# EAGLE design shematic (EAGLE 6.4)
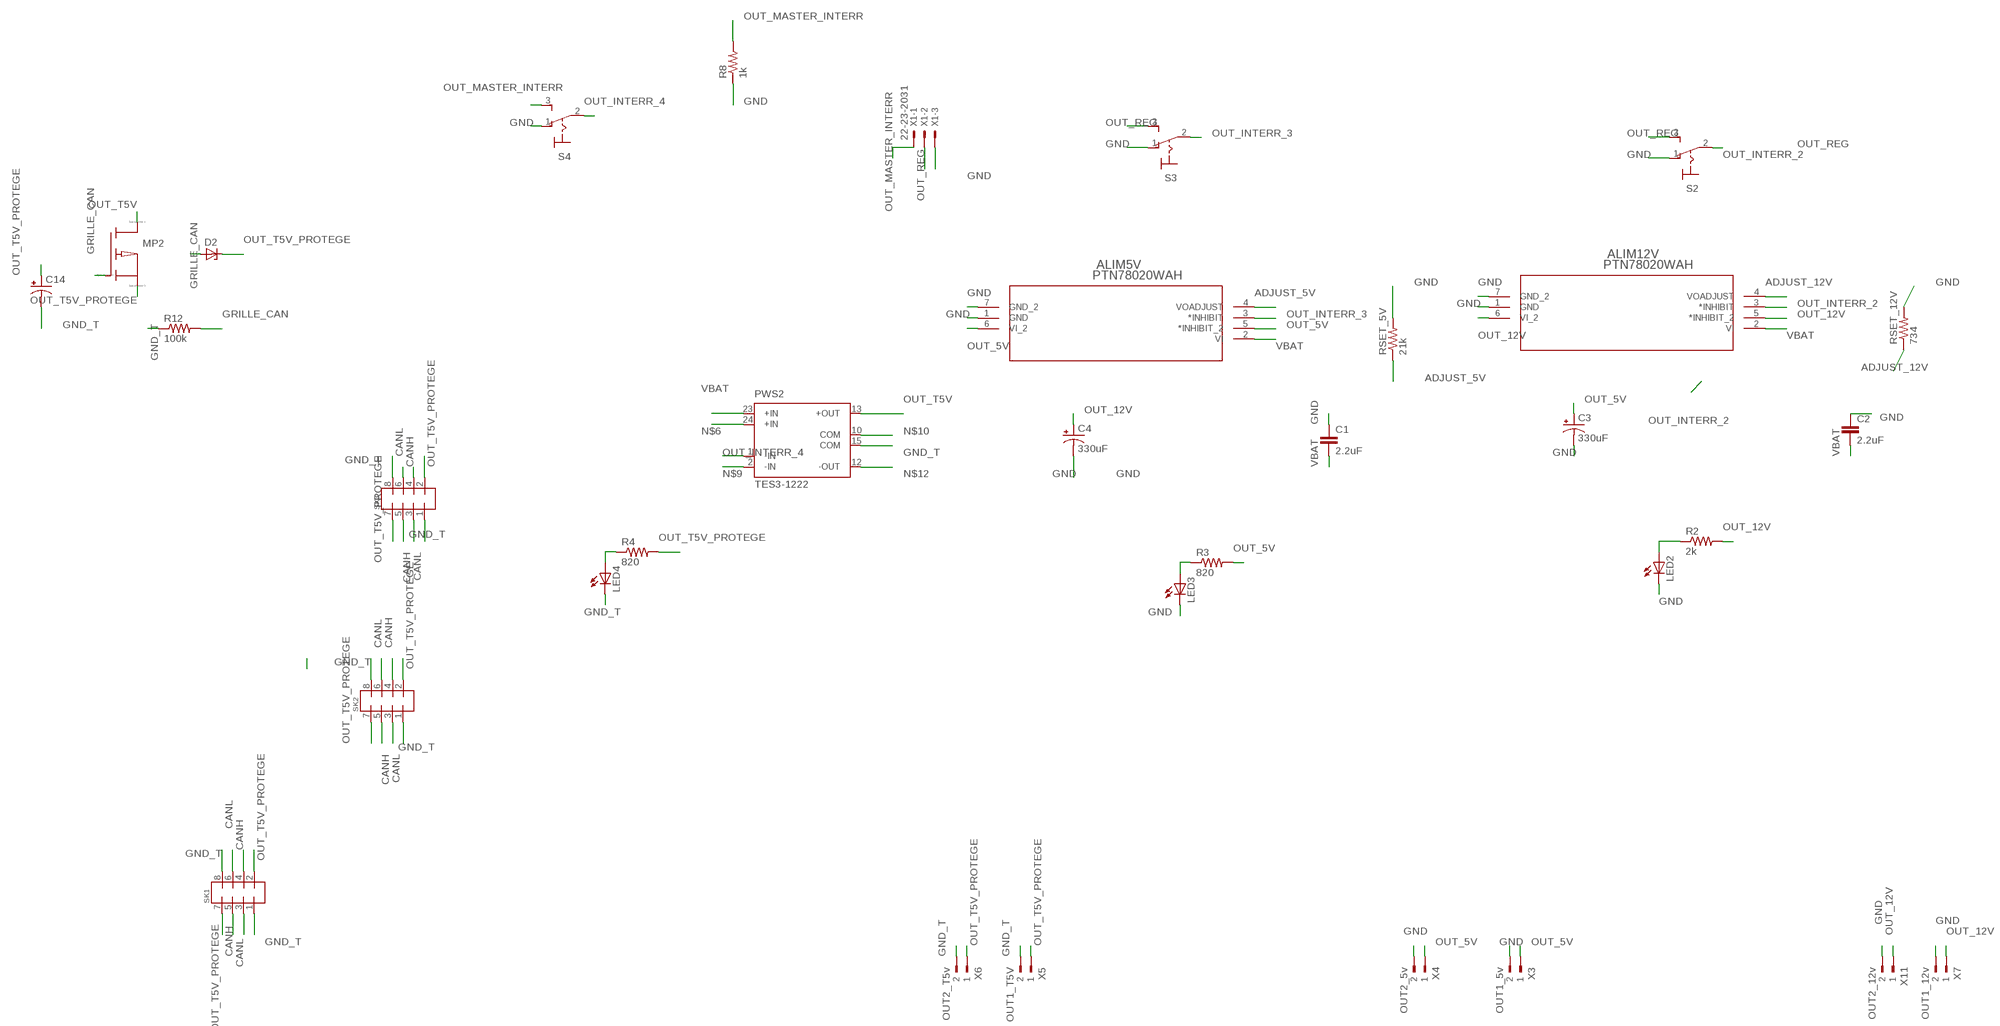
[diagram p0: schematic, sheet 1, part 1 of 2]
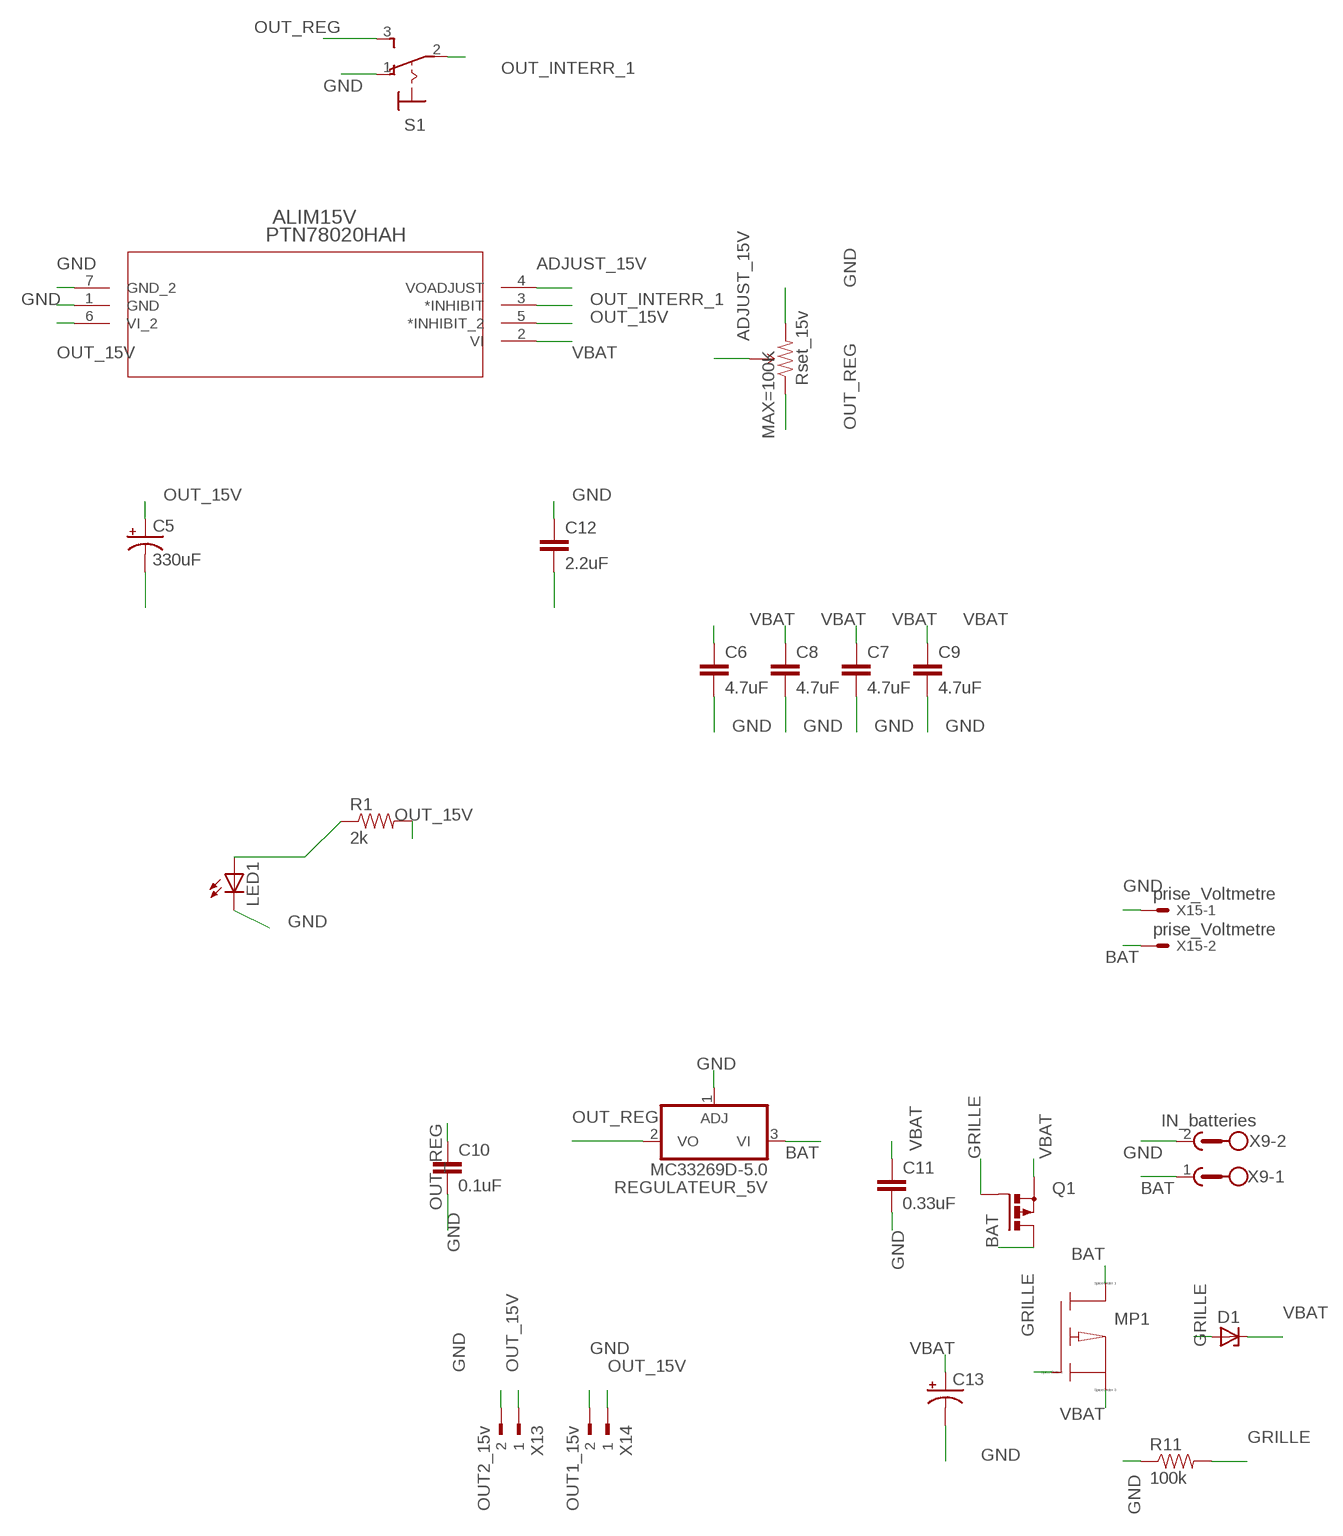
[diagram p1: schematic, sheet 1, part 2 of 2]

## Parts
ALIM5V  PTN78020WAH  PTN78020_  [EUK7]
ALIM12V  PTN78020WAH  PTN78020_  [EUK7]
ALIM15V  PTN78020HAH  PTN78020_  [EUK7]
C1  2.2uF  CAP0805  [0805]
C2  2.2uF  CAP0805  [0805]
C3  330uF  CAP_POLPTH1  [CPOL-RADIAL-100UF-25V]
C4  330uF  CAP_POLPTH1  [CPOL-RADIAL-100UF-25V]
C5  330uF  CAP_POLPTH1  [CPOL-RADIAL-100UF-25V]
C6  4.7uF  CAP0805  [0805]
C7  4.7uF  CAP0805  [0805]
C8  4.7uF  CAP0805  [0805]
C9  4.7uF  CAP0805  [0805]
C10  0.1uF  CAP0805  [0805]
C11  0.33uF  CAP0805  [0805]
C12  2.2uF  CAP0805  [0805]
C13  CAP_POLPTH1  [CPOL-RADIAL-100UF-25V]
C14  CAP_POLPTH1  [CPOL-RADIAL-100UF-25V]
D1  ZENER-DIODESOT23  [SOT23]
D2  ZENER-DIODESOT23  [SOT23]
LED1  LEDCHIP-LED0805  [CHIP-LED0805]
LED2  LEDCHIP-LED0805  [CHIP-LED0805]
LED3  LEDCHIP-LED0805  [CHIP-LED0805]
LED4  LEDCHIP-LED0805  [CHIP-LED0805]
MAX=100K  Rset_15v  TRIMPOT-PTH-KNOB  [3386U]
MP1  PMOS  [SOT23]
MP2  PMOS  [SOT23]
PWS2  TES3-1222  [TES3]
Q1  PMOSFET_PTO220BH  [TO220BH]
R1  2k  RESISTOR0805-RES  [0805]
R2  2k  RESISTOR0805-RES  [0805]
R3  820  RESISTOR0805-RES  [0805]
R4  820  RESISTOR0805-RES  [0805]
R8  1k  RESISTOR0805-RES  [0805]
R11  100k  RESISTOR0805-RES  [0805]
R12  100k  RESISTOR0805-RES  [0805]
REGULATEUR_5V  MC33269D-5.0  [DPACK]
RSET_5V  21k  RESISTOR0805-RES  [0805]
RSET_12V  734  RESISTOR0805-RES  [0805]
S1  M9040P  [M9040P]
S2  M9040P  [M9040P]
S3  M9040P  [M9040P]
S4  M9040P  [M9040P]
SK1  MMATCH-8-PTH  [AMP-215079-8]
SK2  MMATCH-8-PTH  [AMP-215079-8]
SK3  MMATCH-8-PTH  [AMP-215079-8]
X1  22-23-2031  [22-23-2031]
X3  OUT1_5v  90-2  [90-2]
X4  OUT2_5v  90-2  [90-2]
X5  OUT1_T5V  90-2  [90-2]
X6  OUT2_T5v  90-2  [90-2]
X7  OUT1_12v  90-2  [90-2]
X9  IN_batteries  GMSTBA2  [GMSTBA2]
X11  OUT2_12v  90-2  [90-2]
X13  OUT2_15v  90-2  [90-2]
X14  OUT1_15v  90-2  [90-2]
X15  prise_Voltmetre  KK-156-2  [KK-156-2]

## Nets
ADJUST_5V: ALIM5V.4(VOADJUST) RSET_5V.1
ADJUST_12V: ALIM12V.4(VOADJUST) RSET_12V.1
ADJUST_15V: ALIM15V.4(VOADJUST) MAX=100K.2(WIPER)
BAT: MP1.3(D) Q1.D REGULATEUR_5V.3(VI) X9.1 X15.2
CANH: SK1.4 SK1.5 SK2.4 SK2.5 SK3.4 SK3.5
CANL: SK1.3 SK1.6 SK2.3 SK2.6 SK3.3 SK3.6
GND: ALIM5V.1(GND) ALIM5V.7(GND_2) ALIM12V.1(GND) ALIM12V.7(GND_2) ALIM15V.1(GND) ALIM15V.7(GND_2) C1.1 C2.1 C3.2(-) C4.2(-) C5.2(-) C6.2 C7.2 C8.2 C9.2 C10.2 C11.2 C12.1 C13.2(-) LED1.C LED2.C LED3.C MAX=100K.3(CW) R8.1 R11.1 REGULATEUR_5V.1(ADJ) RSET_5V.2 RSET_12V.2 S1.1(O) S2.1(O) S3.1(O) S4.1(O) X1.3 X3.2 X4.2 X7.2 X9.2 X11.2 X13.2 X14.2 X15.1
GND_T: C14.2(-) LED4.C PWS2.15(COM) R12.1 SK1.1 SK1.8 SK2.1 SK2.8 SK3.1 SK3.8 X5.2 X6.2
GRILLE: D1.1(A) MP1.1(G) Q1.G R11.2
GRILLE_CAN: D2.1(A) MP2.1(G) R12.2
N$2: LED1.A R1.1
N$3: LED2.A R2.1
N$4: LED3.A R3.1
N$5: LED4.A R4.1
N$6: PWS2.24(+IN)
N$9: PWS2.2(-IN)
N$10: PWS2.10(COM)
N$12: PWS2.12(-OUT)
OUT_5V: ALIM5V.5(*INHIBIT_2) ALIM5V.6(VI_2) C3.1(+) R3.2 X3.1 X4.1
OUT_12V: ALIM12V.5(*INHIBIT_2) ALIM12V.6(VI_2) C4.1(+) R2.2 X7.1 X11.1
OUT_15V: ALIM15V.5(*INHIBIT_2) ALIM15V.6(VI_2) C5.1(+) R1.2 X13.1 X14.1
OUT_INTERR_1: ALIM15V.3(*INHIBIT) S1.2(P)
OUT_INTERR_2: ALIM12V.3(*INHIBIT) S2.2(P)
OUT_INTERR_3: ALIM5V.3(*INHIBIT) S3.2(P)
OUT_INTERR_4: PWS2.1(-IN) S4.2(P)
OUT_MASTER_INTERR: R8.2 S4.3(S) X1.1
OUT_REG: C10.1 MAX=100K.1(CCW) REGULATEUR_5V.2(VO) S1.3(S) S2.3(S) S3.3(S) X1.2
OUT_T5V: MP2.3(D) PWS2.13(+OUT)
OUT_T5V_PROTEGE: C14.1(+) D2.3(C) MP2.2(S) R4.2 SK1.2 SK1.7 SK2.2 SK2.7 SK3.2 SK3.7 X5.1 X6.1
VBAT: ALIM5V.2(VI) ALIM12V.2(VI) ALIM15V.2(VI) C1.2 C2.2 C6.1 C7.1 C8.1 C9.1 C11.1 C12.2 C13.1(+) D1.3(C) MP1.2(S) PWS2.23(+IN) Q1.S

## Library data of the parts
ALIM5V ALIM12V ALIM15V = ptn78020_:PTN78020_
C1 C2 C6-C12 = SparkFun-Passives:CAP: Capacitor Standard 0603 ceramic capacitor, and 0.1" leaded capacitor.
C3-C5 = SparkFun-Capacitors:CAP_POL: Capacitor Polarized These are standard SMD and PTH capacitors. Normally 10uF, 47uF, and 100uF in electrolytic and tantalum varieties. Always verify the external diameter of the through hole cap, it varies with capacity, voltage, and manufacturer. The EIA devices should be standard.
C13 C14 = SparkFun-Passives:CAP_POL: Capacitor Polarized These are standard SMD and PTH capacitors. Normally 10uF, 47uF, and 100uF in electrolytic and tantalum varieties. Always verify the external diameter of the through hole cap, it varies with capacity, voltage, and manufacturer. The EIA devices should be standard.
D1 D2 = diode:ZENER-DIODE: Z-Diode
LED1-LED4 = adafruit:LED: LED OSRAM: - CHIPLED LG R971, LG N971, LY N971, LG Q971, LY Q971, LO R971, LY R971 LH N974, LH R974 LS Q976, LO Q976, LY Q976 LO Q996 - Hyper CHIPLED LW Q18S LB Q993, LB Q99A, LB R99A - SideLED LS A670, LO A670, LY A670, LG A670, LP A670 LB A673, LV A673, LT A673, LW A673 LH A674 LY A675 LS A676, LA A676, LO A676, LY A676, LW A676 LS A679, LY A679, LG A679 - Hyper Micro SIDELED® LS Y876, LA Y876, LO Y876, LY Y876 LT Y87S - SmartLED LW L88C, LW L88S LB L89C, LB L89S, LG L890 LS L89K, LO L89K, LY L89K LS L896, LA L896, LO L896, LY L896 - TOPLED LS T670, LO T670, LY T670, LG T670, LP T670 LSG T670, LSP T670, LSY T670, LOP T670, LYG T670 LG T671, LOG T671, LSG T671 LB T673, LV T673, LT T673, LW T673 LH T674 LS T676, LA T676, LO T676, LY T676, LB T676, LH T676, LSB T676, LW T676 LB T67C, LV T67C, LT T67C, LS T67K, LO T67K, LY T67K, LW E67C LS E67B, LA E67B, LO E67B, LY E67B, LB E67C, LV E67C, LT E67C LW T67C LS T679, LY T679, LG T679 LS T770, LO T770, LY T770, LG T770, LP T770 LB T773, LV T773, LT T773, LW T773 LH T774 LS E675, LA E675, LY E675, LS T675 LS T776, LA T776, LO T776, LY T776, LB T776 LHGB T686 LT T68C, LB T68C - Hyper Mini TOPLED® LB M676 - Mini TOPLED Santana® LG M470 LS M47K, LO M47K, LY M47K Source: http://www.osram.convergy.de/
MAX=100K = SparkFun-Electromechanical:TRIMPOT: Various small potentiometers for "set-and-forget" applications
MP1 MP2 = sym:PMOS: P-Channel MOSFET transistor
PWS2 = traco-electronic:TES3-: DC/DC Converter Dual Output, 3W Source: Data sheet <http://www.tracopower.com/datasheet_g/tes3-d.pdf>
Q1 = transistor-power:PMOSFET_P: Power MOSFET P-Channel
R1-R4 R8 = SparkFun-Resistors:RESISTOR: Resistor Basic schematic elements and footprints for 0603, 1206, and PTH resistors.
R11 R12 RSET_5V RSET_12V = SparkFun-Passives:RESISTOR: Resistor Basic schematic elements and footprints for 0603, 1206, and PTH resistors.
REGULATEUR_5V = linear:MC33269?*: Adjustable Output Low Dropout Voltage Regulator 800 mA Source: http://www.onsemi.com/pub/Collateral/MC33269-D.PDF
S1-S4 = switch:M9040P: TOGGLE SWITCH Marquardt
SK1-SK3 = jt-con-micromatch:MMATCH-8-*: AMP Micromatch 8-pin
X1 = con-molex:22-23-2031: .100" (2.54mm) Center Header - 3 Pin; MF: MOLEX; MPN: 22-23-2031; OC_FARNELL: 1462950; OC_NEWARK: 30C0862
X3-X7 X11 X13 X14 = con-weidmueller-sl35:90-2: WEIDMUELLER CLAMP CONNECTOR; OC_FARNELL: unknown; OC_NEWARK: unknown
X9 = con-phoenix-762:GMSTBA2: PHOENIX; MF: FARNELL; MPN: 1757242; OC_FARNELL: 3705171; OC_NEWARK: 71C4161
X15 = con-molex:KK-156-2: KK 156 HEADER Source: http://www.molex.com/pdm_docs/sd/026604100_sd.pdf; OC_FARNELL: unknown; OC_NEWARK: unknown

## Net classes
0 default: width 1.016 mm, drill 0.6 mm, clearance 0.3 mm
1 puissance: width 2.86 mm, drill 0.6 mm, clearance 2.86 mm to class 0, clearance 0.073 mm

## Board
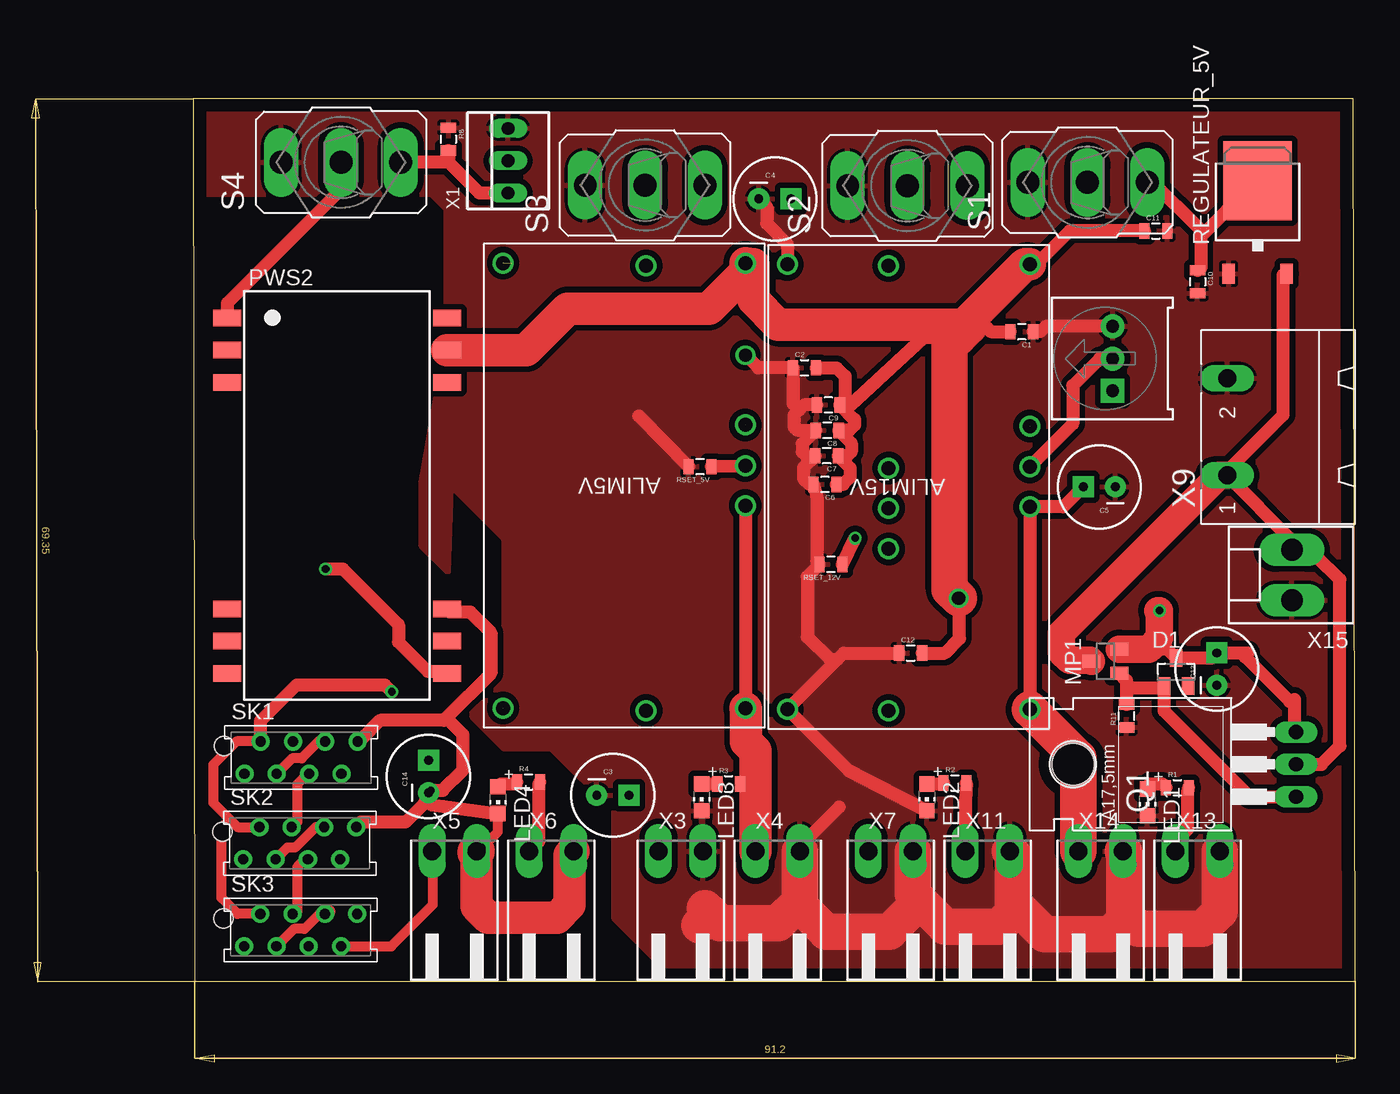
[diagram p2: board, top side]
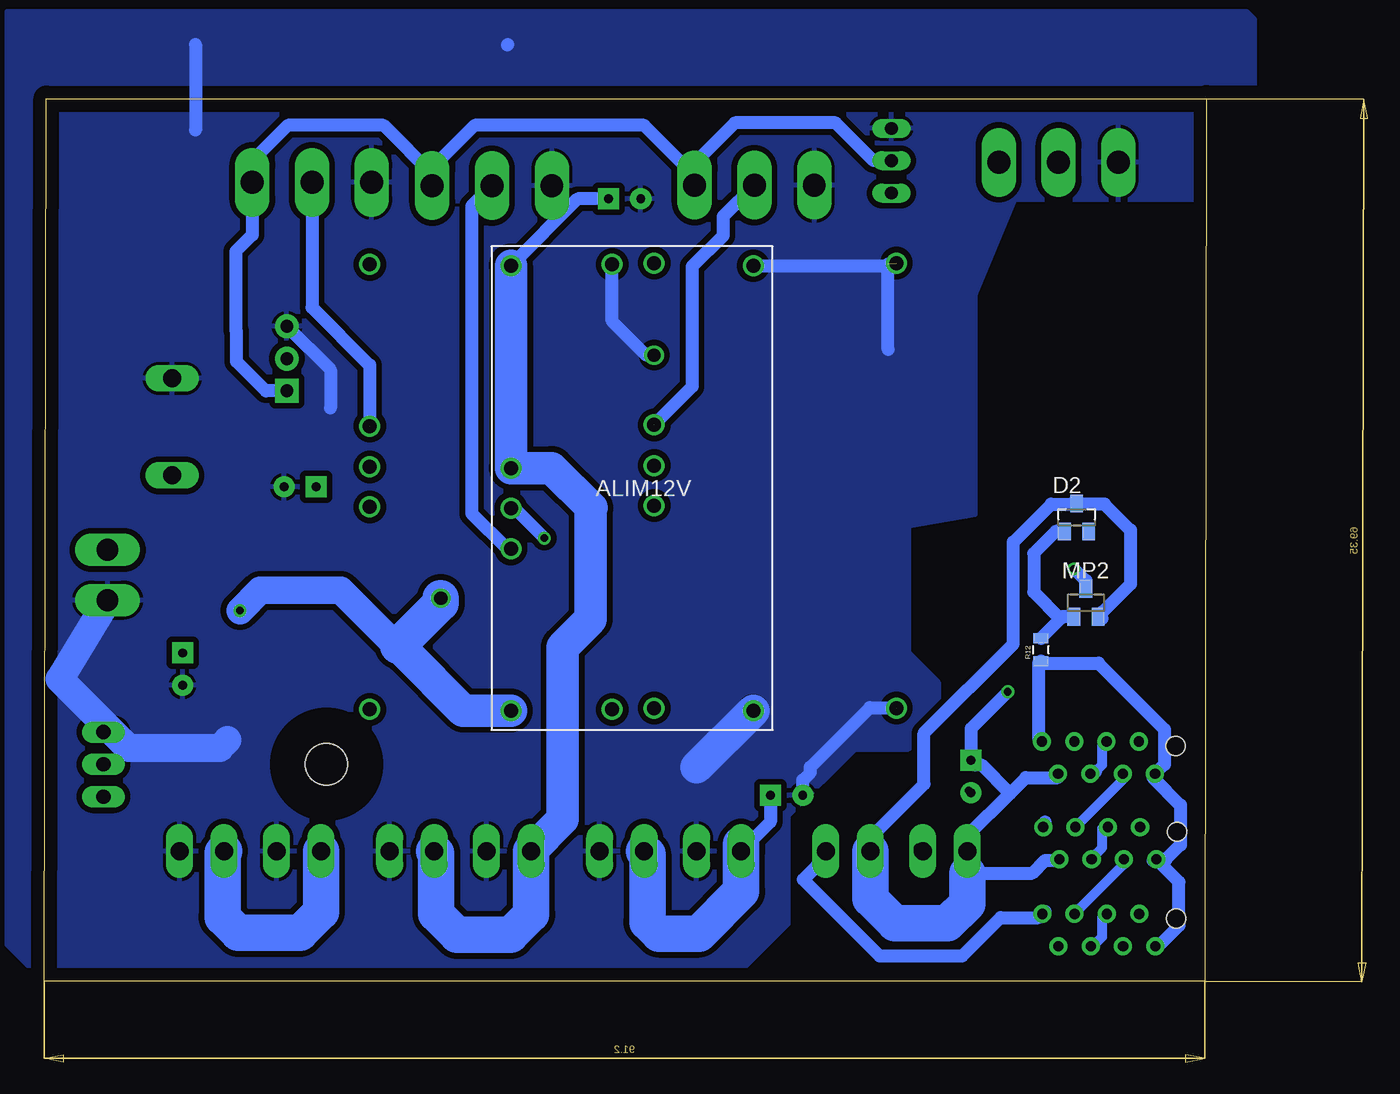
[diagram p3: board, bottom side, seen from below]

Size 91.35 x 69.35 mm. Coordinates in mm from the lower left corner, seen from the top.
Outline: 0.15,0 91.35,0 91.2,69.35 0,69.35 0.15,0
Copper layers (1*16): Top 0.035mm / dielectric 1.5mm / Bottom 0.035mm
Design rules "default *": minimum track width 10mil, minimum drill 24mil, track to track 0.45mm, track to pad 0.45mm, pad to pad 0.45mm, via to via 0.45mm, smd to smd 0.45mm, copper to edge 40mil, drill to drill 8mil, minimum pad ring 10mil, minimum via ring 8mil, stop-mask expansion 4mil, vias tented up to drill 0mil, thermal gap 10mil

### Footprints (pad centres in the part's own frame; a part is rotated, then mirrored left to right if it is on the bottom)
EUK7 = smd 1.016 x 1.016: 1 9.525,-17.475; 2 -9.525,-17.475; 3 -9.525,-4.775; 4 -9.525,-1.575; 5 -9.525,1.575; 6 -9.525,17.475; 7 9.525,17.475 | drill 1.1: P$1 -9.525,-17.475; P$2 -9.525,-4.775; P$3 -9.525,-1.575; P$4 -9.525,1.575; P$5 -9.525,17.475; P$6 9.525,17.475; P$7 9.525,-17.475
0805 = smd 0.8 x 1.2: 1 -0.9,0; 2 0.9,0
CPOL-RADIAL-100UF-25V = drill 0.7 pad 1.651 square: 1 1.27,0 | drill 0.7 pad 1.651: 2 -1.27,0
SOT23 = smd 1 x 1.4: 1 -0.95,-1.1; 2 0.95,-1.1; 3 0,1.1
CHIP-LED0805 = smd 1.2 x 1.2: A 0,-1.05; C 0,1.05
3386U = drill 1.016 pad 1.88 square: 1 -2.54,-0.015 | drill 1.016 pad 1.88: 2 0,-0.015; 3 2.54,-0.015
TES3 = smd 1.3 x 2.2: 1 -13.97,-8.636; 2 -11.43,-8.636; 3 -8.89,-8.636; 10 8.89,-8.636; 11 11.43,-8.636; 12 13.97,-8.636; 13 13.97,8.636; 14 11.43,8.636; 15 8.89,8.636; 22 -8.89,8.636; 23 -11.43,8.636; 24 -13.97,8.636
TO220BH = drill 1.118 long: D 0,-6.35; G -2.54,-6.35; S 2.54,-6.35 | hole 3.302: 0,11.176
DPACK = smd 1 x 1.6: 1 -2.28,-4.8; 3 2.28,-4.8 | smd 5.4 x 6.2: 2 0,2.5
M9040P = drill 1.803 long: 1 0,4.699; 2 0,0; 3 0,-4.699
AMP-215079-8 = drill 0.8 pad 1.422: 1 0,-1.27; 2 1.27,1.27; 3 2.54,-1.27; 4 3.81,1.27; 5 5.08,-1.27; 6 6.35,1.27; 7 7.62,-1.27; 8 8.89,1.27 | hole 1.5: -1.62,0.905
22-23-2031 = drill 1 long: 1 -2.54,0; 2 0,0; 3 2.54,0
90-2 = drill 1.422 long: 1 -1.75,5.25; 2 1.75,5.25
GMSTBA2 = drill 1.397 long: 1 -3.81,5.08; 2 3.81,5.08
KK-156-2 = drill 1.7 pad 2.184 long: 1 -1.98,0; 2 1.98,0

### Placement (x,y rotation side)
ALIM5V  33.9,38.95 180 top
ALIM12V  45.15,38.75 0 bottom
ALIM15V  56.25,38.85 180 top
C1  65.14,51.04 180 top
C2  48.07,48.21 0 top
C3  33.01,14.61 0 top
C4  45.74,61.48 0 top
C5  71.24,38.85 180 top
C6  49.67,39.04 180 top
C7  49.81,41.29 180 top
C8  49.85,43.29 180 top
C9  49.94,45.29 180 top
C10  78.95,54.97 270 top
C11  75.68,58.96 0 top
C12  56.41,25.79 0 top
C13  80.48,24.53 90 top
C14  18.51,16.09 90 top
D1  77.28,24.3 0 top
D2  10.22,36.45 0 bottom
LED1  75.03,14.05 180 top
LED2  57.69,14.45 180 top
LED3  39.99,14.45 180 top
LED4  23.97,14.23 180 top
MAX=100K  72.27,48.93 90 top
MP1  71.71,25.15 90 top
MP2  9.48,29.75 0 bottom
PWS2  11.33,38.16 270 top
Q1  80.35,17.05 90 top
R1  77.38,15.21 0 top
R2  59.89,15.59 0 top
R3  42.11,15.52 0 top
R4  26.37,15.66 0 top
R8  20.07,66.17 270 top
R11  73.38,20.85 90 top
R12  13.02,26.05 90 bottom
REGULATEUR_5V  83.69,60.4 0 top
RSET_5V  39.85,40.44 180 top
RSET_12V  50.14,32.76 180 top
S1  70.31,62.77 90 top
S2  56.16,62.52 90 top
S3  35.54,62.56 90 top
S4  11.63,64.35 90 top
SK1  4.05,17.57 0 top
SK2  3.95,10.85 0 top
SK3  4.02,4.03 0 top
X1  24.77,64.47 90 top
X3  38.33,4.98 0 top
X4  45.95,4.98 0 top
X5  20.55,4.98 0 top
X6  28.17,4.98 0 top
X7  54.84,4.98 0 top
X9  86.38,43.56 90 top
X11  62.46,4.98 0 top
X13  78.97,4.98 0 top
X14  71.35,4.98 0 top
X15  86.38,31.92 90 top

### Tracks (layer width: path | path; a pad name or v marks a point on that pad's centre or on a via)
ADJUST_5V
  Top 1.016: RSET_5V.1 40.89,40.48 ALIM5V.4
ADJUST_12V  (via drill 0.6)
  Top 1.016: RSET_12V.1 v52.05,34.83
  Bottom 0.406: 54.4,37.17 ALIM12V.4
  Bottom 1.016: v52.05,34.83 54.4,37.17
ADJUST_15V
  Top 1.016: MAX=100K.2 71.28,48.93 69.15,46.8 69.15,43.8 ALIM15V.4
BAT
  Top 1.016: Q1.D 88.7,17.05 90.15,18.5 90.15,31.58 88.35,33.38 86.91,33.38 X15.2 86.38,34.67 X9.1 81.7,40.5 85.7,44.5 85.7,55.5 REGULATEUR_5V.3
  Top 2.18: MP1.3 70.53,25.23 68.92,25.23 68.28,25.88 68.28,27.35 80.68,39.76 X9.1
CANH
  Top 0.8: SK2.4 8.2,12.5 8.2,15.5 8.7,16 SK1.5 | SK3.4 8.2,5.5 8.2,9 8.7,9.5 SK2.5
  Bottom 0.8: SK3.4 8.2,5 8.2,3.5 8.7,3 SK3.5 | SK2.4 8.2,12 8.2,10.5 8.7,10 SK2.5 | 8.7,16.5 8.2,17 8.2,18.5 SK1.4
  Bottom 1.016: 8.7,16.5 SK1.5
CANL
  Top 0.8: SK1.6 9.87,18.84 8.55,17.52 7.81,17.52 SK1.3 | SK2.3 7.41,10.5 8.02,10.5 9.64,12.12 SK2.6 | SK3.6 9.95,5.29 8.77,4.12 7.93,4.12 SK3.3
  Top 1.016: 10.7,5.5 SK3.6
  Bottom 0.8: SK1.3 6.59,15.83 SK2.6 | SK2.3 6.49,9.18 SK3.6
GND  (via drill 1)  (2 unrouted)
  Top 1.016: 56.75,9.86 56.59,9.7 | C9.2 48.04,45.29 47.65,44.9 | 47.65,44.9 47.25,44.5 47.25,43.55 47.5,43.3 C8.2 47.9,42.24 47.9,41.6 48.21,41.29 C7.2 48,40.38 48,39.5 48.46,39.04 C6.2 49.04,38.11 49.04,33.01 RSET_12V.2 48.3,31.82 48.3,27.05 50.05,25.3 50.65,25.3 | 50.79,13.69 47.7,10.6 X4.2 | 50.65,25.3 ALIM15V.7 51.51,16.59 LED2.C | 50.65,25.3 51.14,25.79 C12.1 | RSET_5V.2 35.05,44.41 | MAX=100K.3 67.02,51.47 66.6,51.05 C1.1 | C4.2 45.1,60.85 45.1,59.55 46.73,57.92 ALIM15V.1 | 47.65,44.9 47.17,45.38 C2.1 44.44,48.21 v43.45,49.2
  Top 2.86: 40.25,5.75 40.7,5.3 | 40.7,5.3 41.45,4.55 46,4.55 47.7,6.25 X4.2 47.7,5.95 49.75,3.9 54.75,3.9 57.15,6.3 | X11.2 64.45,9.99 64.45,6.2 | 64.45,6.2 64.45,5.4 63.35,4.3 59.15,4.3 57.15,6.3 | 57.15,6.3 56.59,6.86 56.59,9.7 X7.2 | X14.2 73.2,10.13 73.2,5.3 73.45,5.05 | 73.45,5.05 74.35,4.15 79.35,4.15 80.72,5.52 X13.2 | 39.8,4.4 40.7,5.3 | 64.45,6.2 66.95,3.7 72.1,3.7 73.45,5.05
  Bottom 1.016: 54.91,73.59 54.95,73.55 | MAX=100K.3 68.85,48.03 68.85,45.05 | 72.4,38.96 C5.2 | v43.45,49.2 44.05,49.2 46.73,51.88 ALIM15V.1 | 79.46,73.59 79.46,66.89 | ALIM12V.7 25.02,56.23 | 25.02,56.23 25.02,56.38 | 25.02,49.65 25.02,56.23 | C3.2 31.74,15.81 31.15,16.4 31.15,16.82 26.47,21.5 24.4,21.5 ALIM5V.7
  Bottom 2.184: X15.1 90.15,23.75 84.75,18.35 77.55,18.35 76.95,18.95
  Bottom 2.56: ALIM12V.1 40.08,16.82
  pour Bottom (isolate 0.254): -3.8,75.55 -3.15,76.2 94.3,76.2 94.3,2.9 92.45,1.05 36.35,1.05 32.85,4.55 32.85,13.05 27.65,18.25 23.45,18.25 21.05,20.65 21.05,23.45 23.4,25.8 23.4,35.8 18.15,36.7 18.15,54 15.05,61.45 -2.25,61.45 -3.8,63
  pour Top (isolate 0.305): -4.55,76.3 -4.45,76.2 94.75,76.2 94.35,75.8 94.35,3.3 91.95,0.9 37.1,0.9 33.1,4.9 33.1,13.35 28.2,18.25 24.45,18.25 21.95,20.75 21.95,22.95 24.45,25.45 24.45,34.75 20.3,38.9 20.05,32.1 17.95,34.2 17.95,39.2 19.9,50.4 19.9,60.65 18.75,61.8 -1.3,61.8 -4.55,65.05
GND_T  (via drill 0.6)
  Top 0.8: v22.7,10.5 23.97,11.77 LED4.C
  Top 1.016: 21.83,10.7 X5.2 | 21.8,10.73 X5.2 | LED4.C 19.67,13.75 18.68,13.88 C14.2 18.2,14 16.7,12.5 13.2,12.5 SK2.8 | 21.88,10.65 X5.2 | PWS2.15 20.2,29 21.8,29 23.43,27.38 23.43,24.23 19.9,20.7 | SK1.8 13.2,19 14.7,20.5 19.7,20.5 19.9,20.7 | v18.7,15 19.62,15 21.22,16.6 21.22,19.38 19.9,20.7
  Top 2.54: X5.2 22.3,5.9 23.2,5 28.6,5 29.6,6 29.6,9.91 X6.2
  Top 2.86: X5.2 22.2,10.13
  Bottom 1.016: 12.7,12.5 SK2.8 | 4.2,9.5 SK2.1 | 12.7,5.5 SK3.8 13.2,5 16.2,5 19.2,2 25.7,2 31.7,8 29.7,10 X6.2 | 13.2,25 R12.1 | v22.7,10.5 X5.2 | v18.7,15 C14.2 | SK3.1 3.8,2.75 2.17,4.38 2.17,7.8 SK2.1 | SK2.1 3.2,9.58 2.05,10.72 2.05,13.85 4.2,16 SK1.1 3.3,17.05 3.3,19.8 8.5,25 13.2,25 | 13.2,25 13.2,19.11 SK1.8
GRILLE
  Top 1.016: MP1.1 73.38,23.64 73.38,23.02 | 73.38,23.02 R11.2 | 73.38,23.02 76.15,23.02 D1.1 76.33,21.25 83.06,14.51 Q1.G
GRILLE_CAN
  Bottom 1.016: MP2.1 11.31,28.65 11.47,28.5 | 11.47,28.5 R12.2 | D2.1 11.85,35.35 13.57,33.62 13.57,30.6 11.47,28.5
N$2
  Top 1.016: LED1.A 75.2,15.5 76.2,15.5 R1.1
N$3
  Top 1.016: LED2.A 57.7,15.5 58.7,15.5 R2.1
N$4
  Top 1.016: LED3.A 40.2,15.5 41.2,15.5 R3.1
N$5
  Top 1.016: 24.12,15.19 LED4.A 24.2,15.5 25.2,15.5 R4.1
N$7  (via drill 1)
  other vias: 60.15,30.1
N$16  (via drill 1)
  other vias: 43.4,49.2
OUT_5V
  Top 0.5: R3.2 43.74,15.2 44.2,17.05
  Top 1.016: ALIM5V.5 ALIM5V.6
  Top 2.56: ALIM5V.6 43.48,21.43 43.48,18.82 44.2,18.1 44.2,17.05 X4.1
  Bottom 1.016: C3.1 34.28,12.53 X3.1
  Bottom 2.86: X4.1 43.95,9.98 43.95,4.65 43.05,3.75 39.9,3.75 36.58,7.07 X3.1 36.58,10.77
OUT_12V
  Top 1.016: 60.65,10.29 X11.1 60.71,14.17 R2.2
  Bottom 1.016: C4.1 49.42,61.48 ALIM12V.6
  Bottom 2.56: X7.1 50.6,12.72 50.6,26.25 48.4,28.45 48.4,37.15 48.35,37.2 51.48,40.33 ALIM12V.5 ALIM12V.6
  Bottom 2.86: X11.1 60.55,10.07 60.55,5.3 58.9,3.65 54.7,3.65 53.09,5.26 X7.1
OUT_15V
  Top 1.016: 77.22,11.27 X13.1 77.7,11.5 78.2,12 78.2,15 R1.2 | C5.1 68.39,37.27 ALIM15V.5 ALIM15V.6
  Top 2.86: ALIM15V.6 69.6,17.55 X14.1
  Bottom 2.86: X13.1 77.35,10.1 77.35,5.05 76.1,3.8 71.25,3.8 69.6,5.45 X14.1
OUT_INTERR_1  (1 unrouted)
  Bottom 1.016: S1.2 70.31,52.96 65.78,48.42 ALIM15V.3
OUT_INTERR_2
  Bottom 1.016: S2.2 57.75,60.92 57.75,36.75 54.98,33.98 ALIM12V.3
OUT_INTERR_3  (1 unrouted)
  Bottom 1.016: S3.2 38,60.1 38,58.6 40.43,56.17 40.43,46.73 ALIM5V.3
OUT_INTERR_4
  Top 1.016: S4.2 11.63,62.23 2.69,53.29 PWS2.1
OUT_MASTER_INTERR
  Top 1.016: 20.1,64.35 S4.3 | R8.2 20.1,65.25 20.1,64.35 | X1.1 22.52,61.94 20.1,64.35
OUT_REG  (via drill 0.6)
  Top 1.016: 79.2,58.5 79.2,56 C10.1 | 79.2,58.5 83.2,62.5 REGULATEUR_5V.2 | 79.2,58.5 79.2,59 75.2,63 S1.3 | v60.7,63 S2.3
  Bottom 1.016: MAX=100K.1 73.94,46.39 76.25,48.7 76.25,51.1 76.3,51.15 76.3,57.35 75.01,58.64 S1.3 74.5,63.28 74.5,64.97 72.23,67.25 64.7,67.25 60.7,63.25 v60.7,63 | X1.2 26.18,64.47 29.15,67.45 37.08,67.45 40.05,64.47 40.05,62.75 S3.3 40.23,63.28 44.2,67.25 57.53,67.25 60.55,64.22 60.55,62.82 S2.3
OUT_T5V  (via drill 0.6)
  Top 1.016: PWS2.13 19.81,24.35 18.45,24.35 16.15,26.65 16.15,28.02 11.77,32.4 v10.43,32.4
  Bottom 1.016: 9.48,31.48 MP2.3 9.48,31.45 v10.43,32.4
OUT_T5V_PROTEGE  (via drill 0.6)
  Top 0.8: SK3.7 15.58,2.75 18.86,6.04 18.86,10.17 X5.1 | SK1.2 3.42,18.84 1.6,17.02 1.6,14.02 2.91,12.71 | 2.91,12.71 3.5,12.12 SK2.2 | SK3.2 3.5,5.29 2.25,6.55 2.25,12.05 2.91,12.71
  Top 1.016: 26.6,10.41 X6.1 26.7,10.5 27.2,11 27.2,15.5 R4.2 | SK1.2 5.32,20.47 8.15,23.3 15.07,23.3 v15.62,22.75
  Bottom 0.8: 18.7,11.5 18.8,11.4 X5.1 18.8,8.5
  Bottom 1.016: 8.2,28.5 MP2.2 | 8.2,29 MP2.2 | 18.8,8.5 13.7,8.5 12.7,9.5 11.7,9.5 SK2.7 | 18.7,11.5 15.45,14.75 | 15.45,14.75 14.2,16 11.7,16 SK1.7 | 15.45,14.75 17.7,17 18.2,17 C14.1 18.51,19.86 v15.62,22.75 | X6.1 26.2,11.5 22.2,15.5 22.2,19.5 15.2,26.5 15.2,34.5 12.2,37.5 10.7,37.5 D2.3 10.2,37.5 8.02,37.5 5.98,35.45 5.98,31.2 MP2.2
  Bottom 2.86: 18.8,8.5 18.8,6.1 20.35,4.55 24.5,4.55 26.42,6.47 X6.1
VBAT  (via drill 0.6, 1)
  Top 1.016: 59.1,49.55 59.48,49.92 59.95,50.4 59.95,50.6 | C11.1 68.91,58.96 66.28,56.33 ALIM15V.2 | 51.72,45.32 C9.1 52,44.13 52,43.7 51.59,43.29 C8.1 51.75,42.29 51.75,41.6 51.44,41.29 C7.1 51.65,40.35 51.65,39.6 51.09,39.04 C6.1 | 51.72,45.32 57.45,50.6 59.95,50.6 | 59.95,50.6 60.15,50.6 | C12.2 59.09,25.79 60.25,26.95 60.25,30.05 v60.2,30.1 | C2.2 50.59,48.21 51.25,47.55 51.25,45.79 51.72,45.32 | 60.98,51.42 60.98,51.6 60.98,51.92 61.03,51.98 61.4,52.35 62.71,51.04 C1.2 | 75.12,26.1 76.58,26.1 D1.3 80.08,25.4 C13.1 82.7,25.8 | 82.7,25.8 82.92,25.8 | 86.58,22.15 86.58,22 | 86.58,22 86.58,19.71 Q1.S | 86.58,22 86.2,22 82.7,25.5 82.7,25.8
  Top 2.18: 75.84,29.12 v75.98,29.12 75.98,26.95 75.12,26.1 MP1.2
  Top 2.56: ALIM5V.2 44.05,56.35 | 44.05,56.35 44.05,53.55 46,51.6 60.98,51.6 | 44.05,56.35 40.55,52.85 29.45,52.85 26.19,49.59 PWS2.23 | ALIM15V.2 65.38,56.33 61.03,51.98
  Top 2.86: 60.98,51.42 60.15,50.6 | v60.2,30.1 59.48,30.83 59.48,49.92
  Bottom 2.18: v75.98,29.12 74.38,30.73 68.05,30.73 63.25,25.93 63.08,25.93
  Bottom 2.56: ALIM12V.2 58.43,21.27 63.08,25.93 63.53,26.38
  Bottom 2.86: 63.53,26.38 60.2,29.7 v60.2,30.1